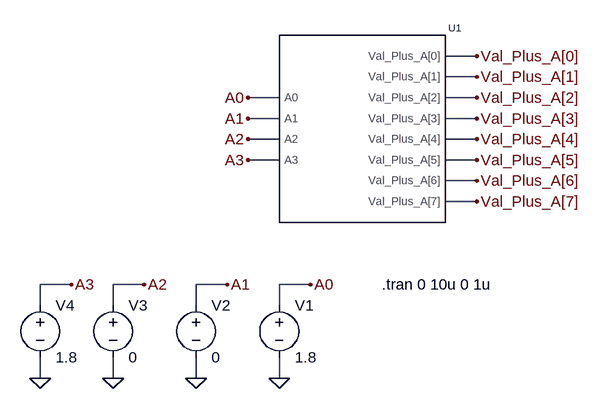
[diagram p0: schematic Val_Plus_A_Test.asc]
Val_Plus_A_Test.asc, the LTspice schematic file:
Version 4
SHEET 1 880 680
WIRE 272 48 224 48
WIRE 272 80 224 80
WIRE -32 112 -80 112
WIRE 272 112 224 112
WIRE -32 144 -80 144
WIRE 272 144 224 144
WIRE -32 176 -80 176
WIRE 272 176 224 176
WIRE -32 208 -80 208
WIRE 272 208 224 208
WIRE 272 240 224 240
WIRE 272 272 224 272
WIRE -352 400 -400 400
WIRE -240 400 -288 400
WIRE -112 400 -160 400
WIRE 16 400 -32 400
WIRE -400 432 -400 400
WIRE -288 432 -288 400
WIRE -160 432 -160 400
WIRE -32 432 -32 400
WIRE -400 544 -400 512
WIRE -288 544 -288 512
WIRE -160 544 -160 512
WIRE -32 544 -32 512
FLAG -32 544 0
FLAG 16 400 A0
FLAG -160 544 0
FLAG -112 400 A1
FLAG -288 544 0
FLAG -240 400 A2
FLAG -400 544 0
FLAG -352 400 A3
FLAG -80 208 A3
FLAG -80 176 A2
FLAG -80 144 A1
FLAG -80 112 A0
FLAG 272 48 Val_Plus_A[0]
FLAG 272 80 Val_Plus_A[1]
FLAG 272 112 Val_Plus_A[2]
FLAG 272 144 Val_Plus_A[3]
FLAG 272 176 Val_Plus_A[4]
FLAG 272 208 Val_Plus_A[5]
FLAG 272 240 Val_Plus_A[6]
FLAG 272 272 Val_Plus_A[7]
SYMBOL Val_Plus_A 80 128 R0
SYMATTR InstName U1
SYMBOL voltage -32 416 R0
WINDOW 123 0 0 Left 0
WINDOW 39 0 0 Left 0
SYMATTR InstName V1
SYMATTR Value 1.8
SYMBOL voltage -160 416 R0
WINDOW 123 0 0 Left 0
WINDOW 39 0 0 Left 0
SYMATTR InstName V2
SYMATTR Value 0
SYMBOL voltage -288 416 R0
WINDOW 123 0 0 Left 0
WINDOW 39 0 0 Left 0
SYMATTR InstName V3
SYMATTR Value 0
SYMBOL voltage -400 416 R0
WINDOW 123 0 0 Left 0
WINDOW 39 0 0 Left 0
SYMATTR InstName V4
SYMATTR Value 1.8
TEXT 126 400 Left 2 !.tran 0 10u 0 1u

The netlist it stands for:
* Val_Plus_A_Test.asc
XU1 A0 A1 A2 A3 Val_Plus_A[0] Val_Plus_A[1] Val_Plus_A[2] Val_Plus_A[3] Val_Plus_A[4] Val_Plus_A[5] Val_Plus_A[6] Val_Plus_A[7] Val_Plus_A  ; pins A0 A1 A2 A3 Val_Plus_A[0] Val_Plus_A[1] Val_Plus_A[2] Val_Plus_A[3] Val_Plus_A[4] Val_Plus_A[5] Val_Plus_A[6] Val_Plus_A[7]
V1 A0 0 1.8
V2 A1 0 0
V3 A2 0 0
V4 A3 0 1.8
.tran 0 10u 0 1u
.lib Val_Plus_A.sub
.backanno
.end